# Altium schematic sheet DCDC.SchDoc
size A4; SheetNumber: 4; SheetTotal: 4
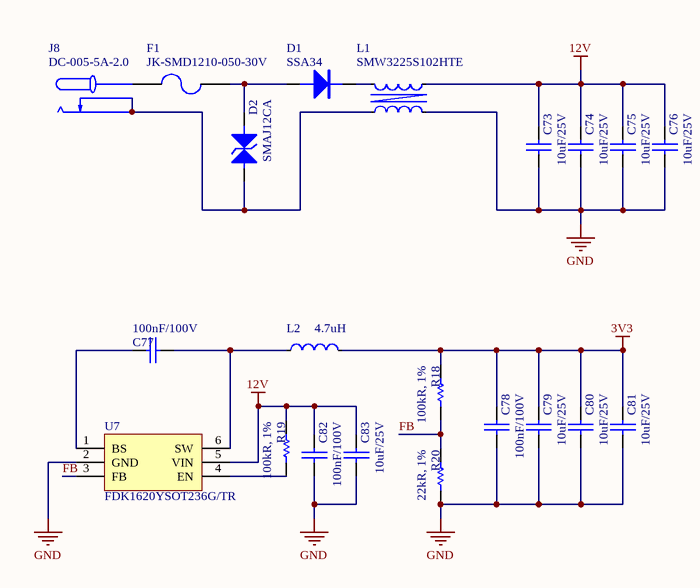
[diagram p0: DCDC.SchDoc]

## Parts
C73  10uF/25V  [0603C]
C74  10uF/25V  [0603C]
C75  10uF/25V  [0603C]
C76  10uF/25V  [0603C]
C77  100nF/100V  [0603C]
C78  100nF/100V  [0603C]
C79  10uF/25V  [0603C]
C80  10uF/25V  [0603C]
C81  10uF/25V  [0603C]
C82  100nF/100V  [0603C]
C83  10uF/25V  [0603C]
D1  SSA34  [SMA/DO-214AC]
D2  SMAJ12CA  [SMA/DO-214AC]
F1  JK-SMD1210-050-30V  [FUSE-1210]
J8  DC-005-5A-2.0  [DC-IN-TH_DC-005-5A-2.0]
L1  SMW3225S102HTE  [INDDFN4_320X250X240L65X80N]
L2  4.7uH  [L0420]
R18  100kR, 1%  [0603R]
R19  100kR, 1%  [0603R]
R20  22kR, 1%  [0603R]
U7  FDK1620YSOT236G/TR  [SOT23-6]

## Nets
3V3: C78.2 C79.2 C80.2 C81.2 L2.2 R18.1
12V: C73.2 C74.2 C75.2 C76.2 C82.2 C83.2 L1.4 R19.1 U7.5(VIN)
GND: C73.1 C74.1 C75.1 C76.1 C78.1 C79.1 C80.1 C81.1 C82.1 C83.1 L1.3 R20.2 U7.2(GND)
FB: R18.2 R20.1 U7.3(FB)
NetC77_1: C77.1 L2.1 U7.6(SW)
NetC77_2: C77.2 U7.1(BS)
NetD1_A: D1.A D2.K F1.2
NetD1_K: D1.K L1.1
NetD2_A: D2.A J8.2 J8.3 L1.2
NetF1_1: F1.1 J8.1
NetR19_2: R19.2 U7.4(EN)

## Library data of the parts
C73-C76 C79-C81 C83 = CAP: CC0603MRX5R8BB106
C77 C78 C82 = CAP: CC0603KRX7R9BB104
D1 = DIODE: 普通二极管
D2 = TVS
F1 = FUSE
J8 = DC-005-5A-2.0: Manufacturer: XKB Connection(中国星坤); Add into BOM: yes; Connector Type: DC电源插座; Inside Contact Diameter: 2mm; Outside Contact Diameter: 6.2mm; Current Rating (Max): 5A; Voltage Rating (Max): 24V; Symbol: DC-005-5A-2.0; Device: DC-005-5A-2.0; LCSC Part Name: DC电源插座 内径:2mm 外径:6.2mm; Supplier Part: C381116; Manufacturer Part: DC-005-5A-2.0; Supplier Footprint: 插件; JLCPCB Part Class: Extended Part; Datasheet: https://atta.szlcsc.com/upload/public/pdf/source/20211015/707A35F7AB6E89C57AAB641950105BB7.pdf; Supplier: LCSC; Convert to PCB: yes; Mounting Style: 弯插; Operating Temperature Range: -20℃~+70℃
L1 = SMW3225S102HTE: 1.2A; Manufacturer: cjiang(长江微电); Symbol: FXL0530-100-M; Add into BOM: yes; Value: 10uH; Tolerance: ±20%; Rated Current: 3.2A; Saturation Current (Isat): 3.5A; DC Resistance (DCR): 125mΩ; Type: 一体成型电感; Device: FXL0530-100-M; LCSC Part Name: 10uH ±20% 3.5A; Supplier Part: C177248; Manufacturer Part: FXL0530-100-M; Supplier Footprint: SMD,5.2x5.4mm; JLCPCB Part Class: Extended Part; Datasheet: https://atta.szlcsc.com/upload/public/pdf/source/20240426/3189EA8206330E2108542F9E34E540E7.pdf; Supplier: LCSC; Convert to PCB: yes
L2 = FXL0420-4R7-M: Manufacturer: cjiang(长江微电); Symbol: FXL0530-100-M; Add into BOM: yes; Value: 10uH; Tolerance: ±20%; Rated Current: 3.2A; Saturation Current (Isat): 3.5A; DC Resistance (DCR): 125mΩ; Type: 一体成型电感; Device: FXL0530-100-M; LCSC Part Name: 10uH ±20% 3.5A; Supplier Part: C177248; Manufacturer Part: FXL0530-100-M; Supplier Footprint: SMD,5.2x5.4mm; JLCPCB Part Class: Extended Part; Datasheet: https://atta.szlcsc.com/upload/public/pdf/source/20240426/3189EA8206330E2108542F9E34E540E7.pdf; Supplier: LCSC; Convert to PCB: yes
R18 R19 = RES: RC0603FR-07100KL
R20 = RES: RC0603FR-0722KL
U7 = FDK1620YSOT236G/TR: DC/DC Converter